# EAGLE design 3v3 VR (EAGLE 6.4)
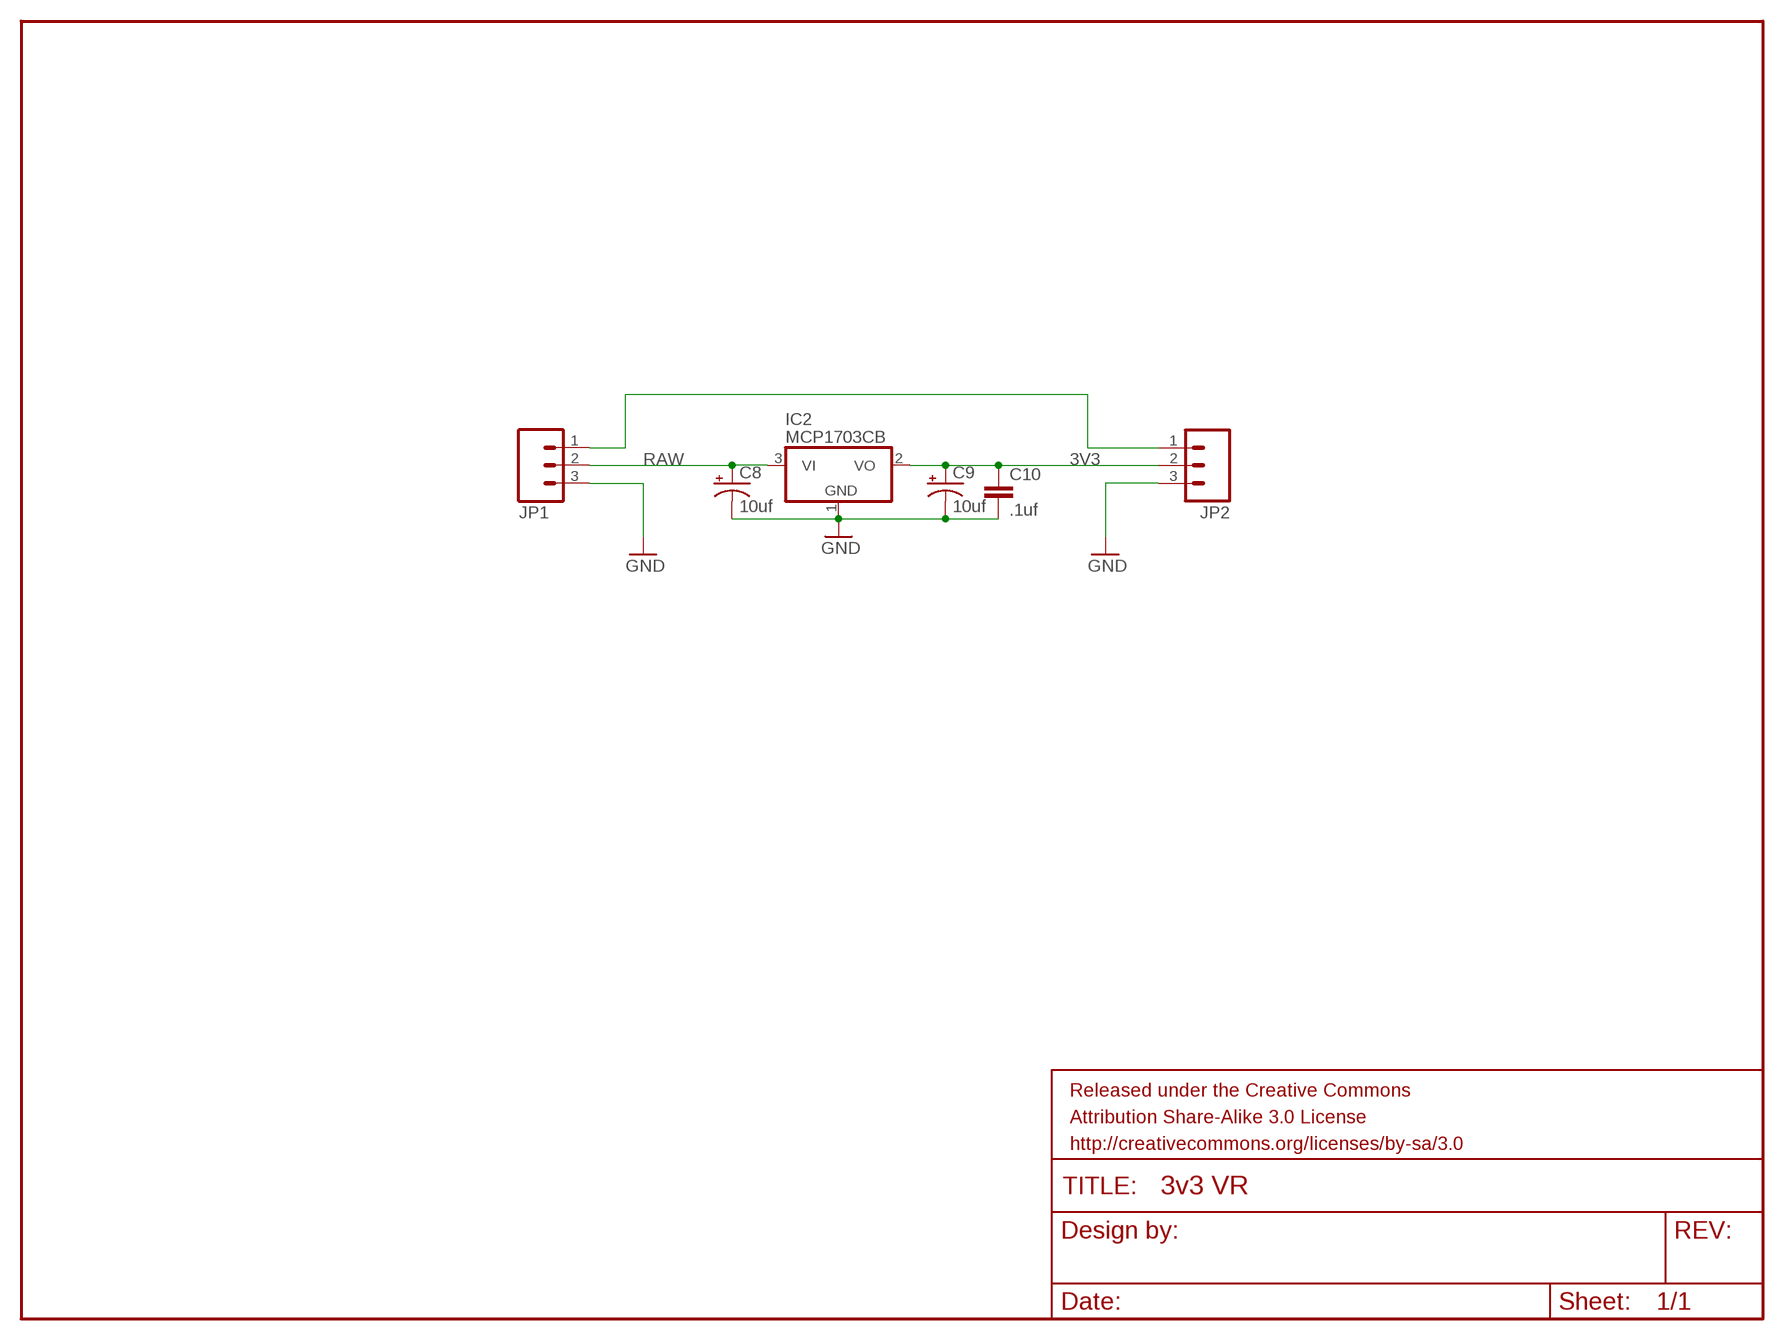
[diagram p0: schematic, sheet 1]

## Parts
C8  10uf  CAP_POL1206  [EIA3216]
C9  10uf  CAP_POL1206  [EIA3216]
C10  .1uf  CAP0402-CAP  [0402-CAP]
FRAME1  FRAME-LETTER  [CREATIVE_COMMONS]
IC2  MCP1703CB  [SOT23]
JP1  M031X03_NO_SILK  [1X03_NO_SILK]
JP2  M031X03_NO_SILK  [1X03_NO_SILK]

## Nets
3V3: C9.A(+) C10.1 IC2.2(VO) JP2.2
GND: C8.C(-) C9.C(-) C10.2 IC2.1(GND) JP1.3 JP2.3
N$1: JP1.1 JP2.1
RAW: C8.A(+) IC2.3(VI) JP1.2

## Library data of the parts
C8 C9 = SparkFun:CAP_POL: Capacitor Polarized These are standard SMD and PTH capacitors. Normally 10uF, 47uF, and 100uF in electrolytic and tantalum varieties. Always verify the external diameter of the through hole cap, it varies with capacity, voltage, and manufacturer. The EIA devices should be standard.
C10 = SparkFun:CAP: Capacitor Standard 0603 ceramic capacitor, and 0.1" leaded capacitor.
FRAME1 = SparkFun-Aesthetics:FRAME-LETTER: Schematic Frame Standard 8.5x11 US Letter frame
IC2 = linear:MCP1703: 250 mA, 16V, Low Quiescent Current LDO Regulator Source: http://ww1.microchip.com/downloads/en/DeviceDoc/22049b.pdf
JP1 JP2 = SparkFun-Connectors:M03: Header 3 Standard 3-pin 0.1" header. Use with straight break away headers (SKU : PRT-00116), right angle break away headers (PRT-00553), swiss pins (PRT-00743), machine pins (PRT-00117), and female headers (PRT-00115). Molex polarized connector foot print use with SKU : PRT-08232 with associated crimp pins and housings.

## Board
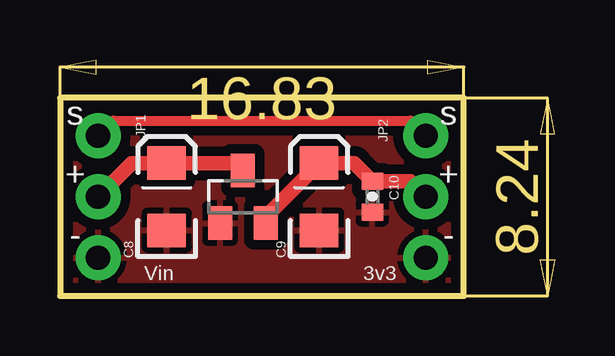
[diagram p1: board, top side]

Size 16.83 x 8.24 mm. Coordinates in mm from the lower left corner, seen from the top.
Outline: 0,0 16.83,0 16.83,8.24 0,8.24 0,0
Copper layers (1*16): Top 0.0356mm / dielectric 1.5011mm / Bottom 0.0356mm
Design rules "LaenPCBOrder": minimum track width 6mil, minimum drill 13mil, track to track 6mil, track to pad 6mil, pad to pad 6mil, via to via 6mil, smd to smd 6mil, copper to edge 15mil, drill to drill 6mil, minimum pad ring 7mil, minimum via ring 7mil, stop-mask expansion 4mil, vias tented up to drill 0mil, thermal gap 10mil

### Footprints (pad centres in the part's own frame; a part is rotated, then mirrored left to right if it is on the bottom)
EIA3216 = smd 1.4 x 1.6: A 1.4,0; C -1.4,0
0402-CAP = smd 0.7 x 0.9: 1 -0.65,0; 2 0.65,0
SOT23 = smd 1 x 1.4: 1 -0.95,-1.1; 2 0.95,-1.1; 3 0,1.1
1X03_NO_SILK = drill 1.016 pad 1.88: 1 0,0; 2 2.54,0; 3 5.08,0

### Placement (x,y rotation side)
C8  4.45,4.13 90 top
C9  10.79,4.13 90 top
C10  13.02,4.13 270 top
FRAME1  -7.62,-9.53 0 top  (outside the outline)
IC2  7.62,4.13 0 top
JP1  1.59,6.67 270 top
JP2  15.24,6.67 270 top

### Tracks (layer width: path | path; a pad name or v marks a point on that pad's centre or on a via)
3V3
  Top 0.61: IC2.2 8.57,3.3 C9.A 12.27,5.53 C10.1 14.59,4.78 JP2.2
GND
  pour Top (isolate 0.406): 0,0 0,8.26 16.83,8.26 16.83,0
N$1
  Top 0.406: JP1.1 2.22,7.3 14.61,7.3 JP2.1
RAW
  Top 0.61: IC2.3 7.32,5.53 C8.A 2.99,5.53 JP1.2

### Text on the board
tPlace: s | s | + | + | - | - | Vin | 3v3